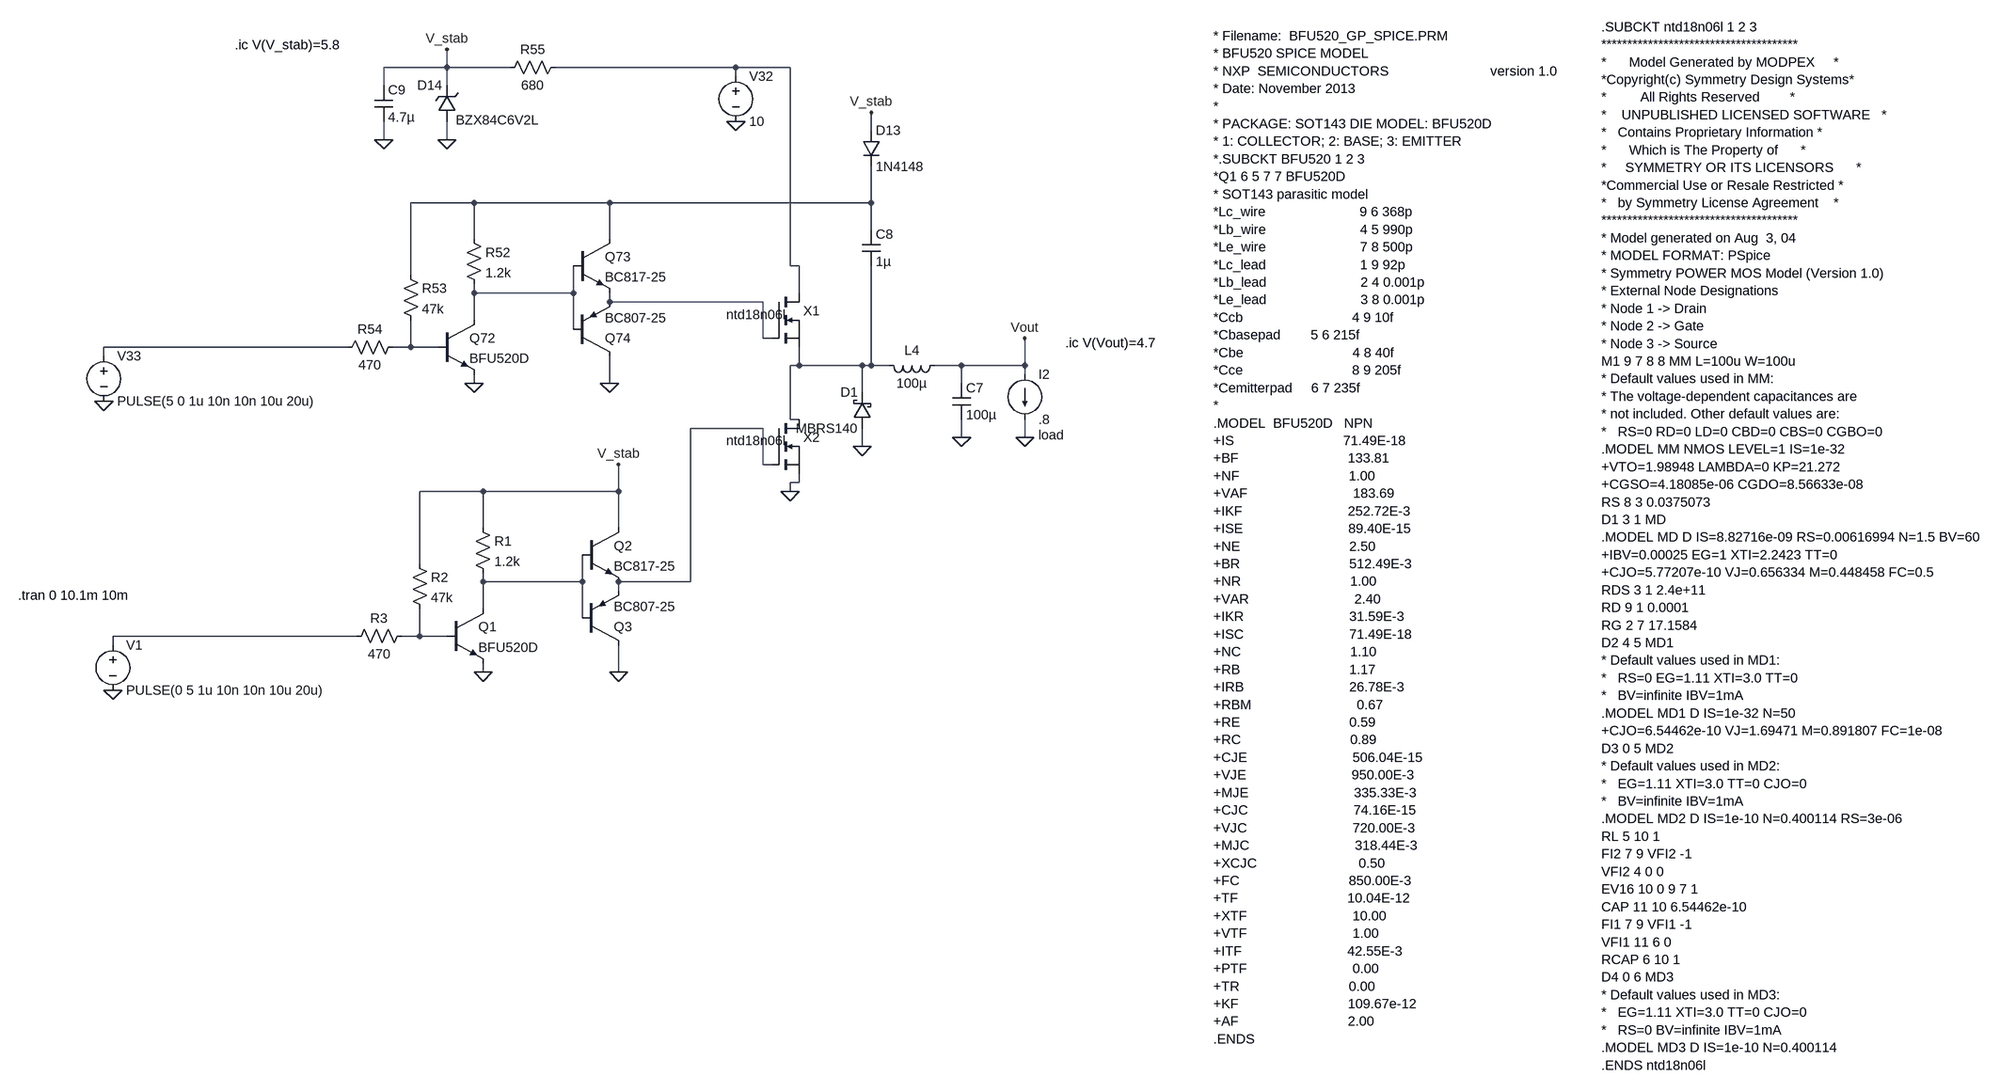
[diagram p0: schematic 02_Buck_sincro.asc]
02_Buck_sincro.asc, the LTspice schematic file:
Version 4
SHEET 1 19032 4508
WIRE 5696 -816 5696 -848
WIRE 5696 -816 5584 -816
WIRE 5808 -816 5696 -816
WIRE 6208 -816 5888 -816
WIRE 6304 -816 6208 -816
WIRE 6208 -800 6208 -816
WIRE 5584 -784 5584 -816
WIRE 5696 -784 5696 -816
WIRE 6448 -704 6448 -736
WIRE 5584 -688 5584 -720
WIRE 5696 -688 5696 -720
WIRE 5744 -576 5632 -576
WIRE 5984 -576 5744 -576
WIRE 6448 -576 6448 -640
WIRE 6448 -576 5984 -576
WIRE 6448 -528 6448 -576
WIRE 5744 -512 5744 -576
WIRE 5984 -512 5984 -576
WIRE 6304 -464 6304 -816
WIRE 6320 -464 6304 -464
WIRE 5632 -448 5632 -576
WIRE 5744 -416 5744 -432
WIRE 5920 -416 5920 -464
WIRE 5920 -416 5744 -416
WIRE 6320 -416 6320 -464
WIRE 5984 -400 5984 -416
WIRE 6256 -400 5984 -400
WIRE 5744 -368 5744 -416
WIRE 5920 -352 5920 -416
WIRE 6256 -336 6256 -400
WIRE 6272 -336 6256 -336
WIRE 5520 -320 5088 -320
WIRE 5632 -320 5632 -368
WIRE 5632 -320 5600 -320
WIRE 5680 -320 5632 -320
WIRE 5088 -304 5088 -320
WIRE 6320 -288 6320 -320
WIRE 6320 -288 6304 -288
WIRE 6432 -288 6320 -288
WIRE 6448 -288 6448 -464
WIRE 6448 -288 6432 -288
WIRE 6480 -288 6448 -288
WIRE 6608 -288 6560 -288
WIRE 6720 -288 6720 -336
WIRE 6720 -288 6608 -288
WIRE 6720 -272 6720 -288
WIRE 5744 -256 5744 -272
WIRE 5984 -256 5984 -304
WIRE 6608 -256 6608 -288
WIRE 6432 -240 6432 -288
WIRE 6304 -192 6304 -288
WIRE 6320 -192 6304 -192
WIRE 6256 -176 6128 -176
WIRE 6608 -160 6608 -192
WIRE 6720 -160 6720 -192
WIRE 6432 -144 6432 -176
WIRE 6256 -112 6256 -176
WIRE 6272 -112 6256 -112
WIRE 6320 -80 6320 -96
WIRE 6320 -80 6304 -80
WIRE 5760 -64 5648 -64
WIRE 6000 -64 6000 -112
WIRE 6000 -64 5760 -64
WIRE 6304 -64 6304 -80
WIRE 5760 0 5760 -64
WIRE 6000 0 6000 -64
WIRE 5648 64 5648 -64
WIRE 5760 96 5760 80
WIRE 5936 96 5936 48
WIRE 5936 96 5760 96
WIRE 6128 96 6128 -176
WIRE 6128 96 6000 96
WIRE 6000 112 6000 96
WIRE 5760 144 5760 96
WIRE 5936 160 5936 96
WIRE 5536 192 5104 192
WIRE 5648 192 5648 144
WIRE 5648 192 5616 192
WIRE 5696 192 5648 192
WIRE 5104 208 5104 192
WIRE 5760 256 5760 240
WIRE 6000 256 6000 208
FLAG 6208 -720 0
FLAG 5088 -224 0
FLAG 6720 -160 0
FLAG 6608 -160 0
FLAG 5744 -256 0
FLAG 5984 -256 0
FLAG 6448 -736 V_stab
FLAG 5696 -688 0
FLAG 5584 -688 0
FLAG 5696 -848 V_stab
FLAG 6720 -336 Vout
FLAG 5104 288 0
FLAG 5760 256 0
FLAG 6000 256 0
FLAG 6304 -64 0
FLAG 6000 -112 V_stab
FLAG 6432 -144 0
SYMBOL voltage 6208 -816 R0
WINDOW 123 0 0 Left 0
WINDOW 39 0 0 Left 0
SYMATTR InstName V32
SYMATTR Value 10
SYMBOL voltage 5088 -320 R0
WINDOW 123 0 0 Left 0
WINDOW 39 0 0 Left 0
SYMATTR InstName V33
SYMATTR Value PULSE(5 0 1u 10n 10n 10u 20u)
SYMBOL ind 6576 -304 R90
WINDOW 0 5 56 VBottom 2
WINDOW 3 32 56 VTop 2
SYMATTR InstName L4
SYMATTR Value 100µ
SYMATTR SpiceLine Rser=30m
SYMBOL cap 6592 -256 R0
SYMATTR InstName C7
SYMATTR Value 100µ
SYMBOL current 6720 -272 R0
WINDOW 123 0 0 Left 0
WINDOW 39 24 108 Left 2
SYMATTR SpiceLine load
SYMATTR InstName I2
SYMATTR Value .8
SYMBOL npn 5680 -368 R0
SYMATTR InstName Q72
SYMATTR Value BFU520D
SYMBOL npn 5920 -512 R0
SYMATTR InstName Q73
SYMATTR Value BC817-25
SYMBOL pnp 5920 -304 M180
SYMATTR InstName Q74
SYMATTR Value BC807-25
SYMBOL res 5728 -528 R0
SYMATTR InstName R52
SYMATTR Value 1.2k
SYMBOL res 5616 -464 R0
SYMATTR InstName R53
SYMATTR Value 47k
SYMBOL res 5616 -336 R90
WINDOW 0 0 56 VBottom 2
WINDOW 3 32 56 VTop 2
SYMATTR InstName R54
SYMATTR Value 470
SYMBOL diode 6432 -704 R0
SYMATTR InstName D13
SYMATTR Value 1N4148
SYMBOL cap 6432 -528 R0
SYMATTR InstName C8
SYMATTR Value 1µ
SYMBOL res 5904 -832 R90
WINDOW 0 0 56 VBottom 2
WINDOW 3 32 56 VTop 2
SYMATTR InstName R55
SYMATTR Value 680
SYMBOL zener 5712 -720 R180
WINDOW 0 24 64 Left 2
WINDOW 3 -147 3 Left 2
SYMATTR InstName D14
SYMATTR Value BZX84C6V2L
SYMATTR Description Diode
SYMATTR Type diode
SYMBOL cap 5568 -784 R0
SYMATTR InstName C9
SYMATTR Value 4.7µ
SYMBOL Nmos 6272 -416 R0
WINDOW 3 -81 38 Left 2
SYMATTR Value ntd18n06l
SYMATTR InstName X1
SYMBOL voltage 5104 192 R0
WINDOW 123 0 0 Left 0
WINDOW 39 0 0 Left 0
SYMATTR InstName V1
SYMATTR Value PULSE(0 5 1u 10n 10n 10u 20u)
SYMBOL npn 5696 144 R0
SYMATTR InstName Q1
SYMATTR Value BFU520D
SYMBOL npn 5936 0 R0
SYMATTR InstName Q2
SYMATTR Value BC817-25
SYMBOL pnp 5936 208 M180
SYMATTR InstName Q3
SYMATTR Value BC807-25
SYMBOL res 5744 -16 R0
SYMATTR InstName R1
SYMATTR Value 1.2k
SYMBOL res 5632 48 R0
SYMATTR InstName R2
SYMATTR Value 47k
SYMBOL res 5632 176 R90
WINDOW 0 0 56 VBottom 2
WINDOW 3 32 56 VTop 2
SYMATTR InstName R3
SYMATTR Value 470
SYMBOL Nmos 6272 -192 R0
WINDOW 3 -81 38 Left 2
SYMATTR Value ntd18n06l
SYMATTR InstName X2
SYMBOL schottky 6448 -176 R180
WINDOW 0 24 64 Left 2
WINDOW 3 24 0 Left 2
SYMATTR InstName D1
SYMATTR Value MBRS140
SYMATTR Description Diode
SYMATTR Type diode
TEXT 5320 -856 Left 2 !.ic V(V_stab)=5.8
TEXT 4936 120 Left 2 !.tran 0 10.1m 10m
TEXT 7264 -872 Left 2 !* Filename:  BFU520_GP_SPICE.PRM\n* BFU520 SPICE MODEL\n* NXP  SEMICONDUCTORS                           version 1.0\n* Date: November 2013\n*\n* PACKAGE: SOT143 DIE MODEL: BFU520D\n* 1: COLLECTOR; 2: BASE; 3: EMITTER\n*.SUBCKT BFU520 1 2 3\n*Q1 6 5 7 7 BFU520D\n* SOT143 parasitic model\n*Lc_wire                         9 6 368p\n*Lb_wire                         4 5 990p\n*Le_wire                         7 8 500p\n*Lc_lead                         1 9 92p\n*Lb_lead                         2 4 0.001p\n*Le_lead                         3 8 0.001p\n*Ccb                             4 9 10f\n*Cbasepad        5 6 215f\n*Cbe                             4 8 40f\n*Cce                             8 9 205f\n*Cemitterpad     6 7 235f\n*\n.MODEL  BFU520D   NPN\n+IS                             71.49E-18\n+BF                             133.81\n+NF                             1.00\n+VAF                            183.69\n+IKF                            252.72E-3\n+ISE                            89.40E-15\n+NE                             2.50\n+BR                             512.49E-3\n+NR                             1.00\n+VAR                            2.40\n+IKR                            31.59E-3\n+ISC                            71.49E-18\n+NC                             1.10\n+RB                             1.17\n+IRB                            26.78E-3\n+RBM                            0.67\n+RE                             0.59\n+RC                             0.89\n+CJE                            506.04E-15\n+VJE                            950.00E-3\n+MJE                            335.33E-3\n+CJC                            74.16E-15\n+VJC                            720.00E-3\n+MJC                            318.44E-3\n+XCJC                           0.50\n+FC                             850.00E-3\n+TF                             10.04E-12\n+XTF                            10.00\n+VTF                            1.00\n+ITF                            42.55E-3\n+PTF                            0.00\n+TR                             0.00\n+KF                             109.67e-12\n+AF                             2.00\n.ENDS
TEXT 7952 -888 Left 2 !.SUBCKT ntd18n06l 1 2 3\n**************************************\n*      Model Generated by MODPEX     *\n*Copyright(c) Symmetry Design Systems*\n*         All Rights Reserved        *\n*    UNPUBLISHED LICENSED SOFTWARE   *\n*   Contains Proprietary Information *\n*      Which is The Property of      *\n*     SYMMETRY OR ITS LICENSORS      *\n*Commercial Use or Resale Restricted *\n*   by Symmetry License Agreement    *\n**************************************\n* Model generated on Aug  3, 04\n* MODEL FORMAT: PSpice\n* Symmetry POWER MOS Model (Version 1.0)\n* External Node Designations\n* Node 1 -> Drain\n* Node 2 -> Gate\n* Node 3 -> Source\nM1 9 7 8 8 MM L=100u W=100u\n* Default values used in MM:\n* The voltage-dependent capacitances are\n* not included. Other default values are:\n*   RS=0 RD=0 LD=0 CBD=0 CBS=0 CGBO=0\n.MODEL MM NMOS LEVEL=1 IS=1e-32\n+VTO=1.98948 LAMBDA=0 KP=21.272\n+CGSO=4.18085e-06 CGDO=8.56633e-08\nRS 8 3 0.0375073\nD1 3 1 MD\n.MODEL MD D IS=8.82716e-09 RS=0.00616994 N=1.5 BV=60\n+IBV=0.00025 EG=1 XTI=2.2423 TT=0\n+CJO=5.77207e-10 VJ=0.656334 M=0.448458 FC=0.5\nRDS 3 1 2.4e+11\nRD 9 1 0.0001\nRG 2 7 17.1584\nD2 4 5 MD1\n* Default values used in MD1:\n*   RS=0 EG=1.11 XTI=3.0 TT=0\n*   BV=infinite IBV=1mA\n.MODEL MD1 D IS=1e-32 N=50\n+CJO=6.54462e-10 VJ=1.69471 M=0.891807 FC=1e-08\nD3 0 5 MD2\n* Default values used in MD2:\n*   EG=1.11 XTI=3.0 TT=0 CJO=0\n*   BV=infinite IBV=1mA\n.MODEL MD2 D IS=1e-10 N=0.400114 RS=3e-06\nRL 5 10 1\nFI2 7 9 VFI2 -1\nVFI2 4 0 0\nEV16 10 0 9 7 1\nCAP 11 10 6.54462e-10\nFI1 7 9 VFI1 -1\nVFI1 11 6 0\nRCAP 6 10 1\nD4 0 6 MD3\n* Default values used in MD3:\n*   EG=1.11 XTI=3.0 TT=0 CJO=0\n*   RS=0 BV=infinite IBV=1mA\n.MODEL MD3 D IS=1e-10 N=0.400114\n.ENDS ntd18n06l
TEXT 6792 -328 Left 2 !.ic V(Vout)=4.7

The netlist it stands for:
* 02_Buck_sincro.asc
V32 N001 0 10
V33 N005 0 PULSE(5 0 1u 10n 10n 10u 20u)
L4 Vout N007 100µ Rser=30m
C7 Vout 0 100µ
I2 Vout 0 .8 load
Q72 N003 N006 0 0 BFU520D
Q73 N002 N003 N004 0 BC817-25
Q74 0 N003 N004 0 BC807-25
R52 N002 N003 1.2k
R53 N002 N006 47k
R54 N006 N005 470
D13 V_stab N002 1N4148
C8 N002 N007 1µ
R55 N001 V_stab 680
D14 0 V_stab BZX84C6V2L
C9 V_stab 0 4.7µ
M§X1 N001 N004 N007 N007 ntd18n06l
V1 N010 0 PULSE(0 5 1u 10n 10n 10u 20u)
Q1 N009 N011 0 0 BFU520D
Q2 V_stab N009 N008 0 BC817-25
Q3 0 N009 N008 0 BC807-25
R1 V_stab N009 1.2k
R2 V_stab N011 47k
R3 N011 N010 470
M§X2 N007 N008 0 0 ntd18n06l
D1 0 N007 MBRS140
.model D D
.lib standard.dio
.model NPN NPN
.model PNP PNP
.lib standard.bjt
.model NMOS NMOS
.model PMOS PMOS
.lib standard.mos
.ic V(V_stab)=5.8
.tran 0 10.1m 10m
* Filename:  BFU520_GP_SPICE.PRM
* BFU520 SPICE MODEL
* NXP  SEMICONDUCTORS                           version 1.0
* Date: November 2013
*
* PACKAGE: SOT143 DIE MODEL: BFU520D
* 1: COLLECTOR; 2: BASE; 3: EMITTER
*.SUBCKT BFU520 1 2 3
*Q1 6 5 7 7 BFU520D
* SOT143 parasitic model
*Lc_wire                         9 6 368p
*Lb_wire                         4 5 990p
*Le_wire                         7 8 500p
*Lc_lead                         1 9 92p
*Lb_lead                         2 4 0.001p
*Le_lead                         3 8 0.001p
*Ccb                             4 9 10f
*Cbasepad        5 6 215f
*Cbe                             4 8 40f
*Cce                             8 9 205f
*Cemitterpad     6 7 235f
*
.MODEL  BFU520D   NPN
+IS                             71.49E-18
+BF                             133.81
+NF                             1.00
+VAF                            183.69
+IKF                            252.72E-3
+ISE                            89.40E-15
+NE                             2.50
+BR                             512.49E-3
+NR                             1.00
+VAR                            2.40
+IKR                            31.59E-3
+ISC                            71.49E-18
+NC                             1.10
+RB                             1.17
+IRB                            26.78E-3
+RBM                            0.67
+RE                             0.59
+RC                             0.89
+CJE                            506.04E-15
+VJE                            950.00E-3
+MJE                            335.33E-3
+CJC                            74.16E-15
+VJC                            720.00E-3
+MJC                            318.44E-3
+XCJC                           0.50
+FC                             850.00E-3
+TF                             10.04E-12
+XTF                            10.00
+VTF                            1.00
+ITF                            42.55E-3
+PTF                            0.00
+TR                             0.00
+KF                             109.67e-12
+AF                             2.00
.ENDS
.SUBCKT ntd18n06l 1 2 3
**************************************
*      Model Generated by MODPEX     *
*Copyright(c) Symmetry Design Systems*
*         All Rights Reserved        *
*    UNPUBLISHED LICENSED SOFTWARE   *
*   Contains Proprietary Information *
*      Which is The Property of      *
*     SYMMETRY OR ITS LICENSORS      *
*Commercial Use or Resale Restricted *
*   by Symmetry License Agreement    *
**************************************
* Model generated on Aug  3, 04
* MODEL FORMAT: PSpice
* Symmetry POWER MOS Model (Version 1.0)
* External Node Designations
* Node 1 -> Drain
* Node 2 -> Gate
* Node 3 -> Source
M1 9 7 8 8 MM L=100u W=100u
* Default values used in MM:
* The voltage-dependent capacitances are
* not included. Other default values are:
*   RS=0 RD=0 LD=0 CBD=0 CBS=0 CGBO=0
.MODEL MM NMOS LEVEL=1 IS=1e-32
+VTO=1.98948 LAMBDA=0 KP=21.272
+CGSO=4.18085e-06 CGDO=8.56633e-08
RS 8 3 0.0375073
D1 3 1 MD
.MODEL MD D IS=8.82716e-09 RS=0.00616994 N=1.5 BV=60
+IBV=0.00025 EG=1 XTI=2.2423 TT=0
+CJO=5.77207e-10 VJ=0.656334 M=0.448458 FC=0.5
RDS 3 1 2.4e+11
RD 9 1 0.0001
RG 2 7 17.1584
D2 4 5 MD1
* Default values used in MD1:
*   RS=0 EG=1.11 XTI=3.0 TT=0
*   BV=infinite IBV=1mA
.MODEL MD1 D IS=1e-32 N=50
+CJO=6.54462e-10 VJ=1.69471 M=0.891807 FC=1e-08
D3 0 5 MD2
* Default values used in MD2:
*   EG=1.11 XTI=3.0 TT=0 CJO=0
*   BV=infinite IBV=1mA
.MODEL MD2 D IS=1e-10 N=0.400114 RS=3e-06
RL 5 10 1
FI2 7 9 VFI2 -1
VFI2 4 0 0
EV16 10 0 9 7 1
CAP 11 10 6.54462e-10
FI1 7 9 VFI1 -1
VFI1 11 6 0
RCAP 6 10 1
D4 0 6 MD3
* Default values used in MD3:
*   EG=1.11 XTI=3.0 TT=0 CJO=0
*   RS=0 BV=infinite IBV=1mA
.MODEL MD3 D IS=1e-10 N=0.400114
.ENDS ntd18n06l
.ic V(Vout)=4.7
.backanno
.end